# Altium schematic sheet PWR_DC_IN.SchDoc
size 420 x 297 mm; Scale: 1:1; DocumentType: Схема электрическая принципиальная; SheetNumber: 3; SheetTotal: 32; DocumentTypeShort: Э3; DocumentInvertoryNumber: ㅤ
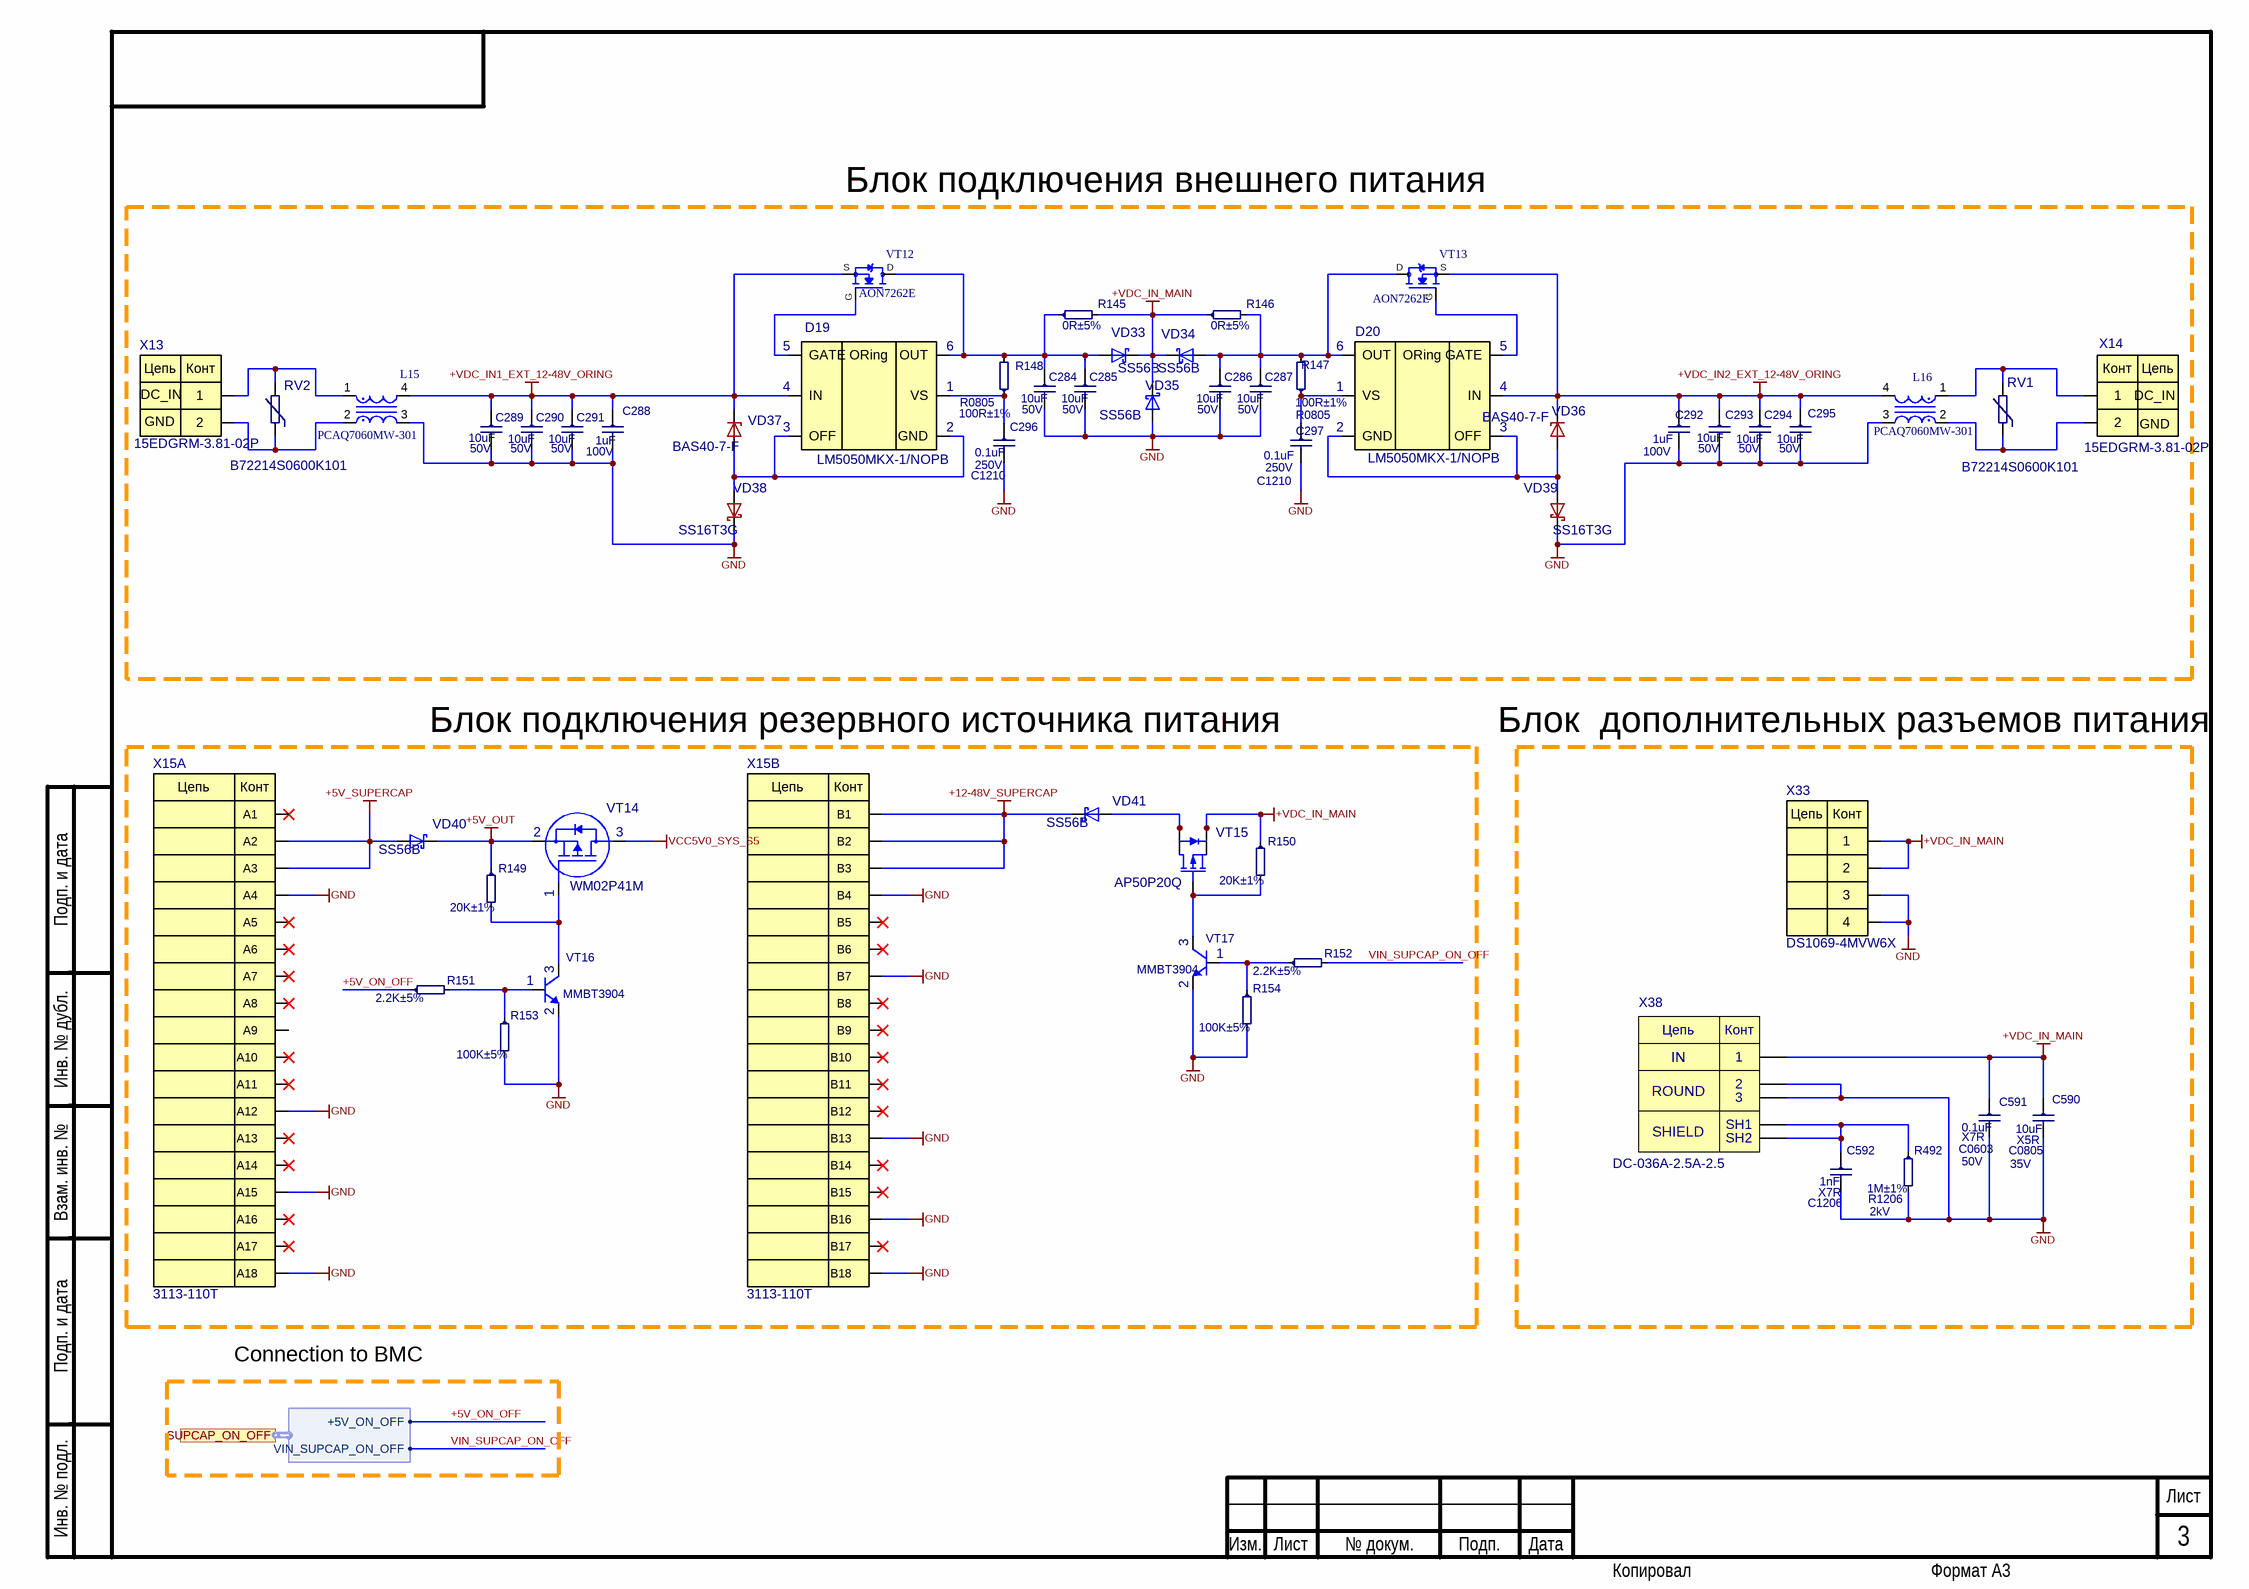
[diagram p0: PWR_DC_IN.SchDoc]

## Parts
C284  10uF  Voltage: 50V  [C1206]
C285  10uF  Voltage: 50V  [C1206]
C286  10uF  Voltage: 50V  [C1206]
C287  10uF  Voltage: 50V  [C1206]
C288  1uF  Voltage: 100V  [C1206]
C289  10uF  Voltage: 50V  [C1206]
C290  10uF  Voltage: 50V  [C1206]
C291  10uF  Voltage: 50V  [C1206]
C292  1uF  Voltage: 100V  [C1206]
C293  10uF  Voltage: 50V  [C1206]
C294  10uF  Voltage: 50V  [C1206]
C295  10uF  Voltage: 50V  [C1206]
C296  0.1uF  Voltage: 250V  [C1210]
C297  0.1uF  Voltage: 250V  [C1210]
C590  10uF  Dielectric: X5R  Voltage: 35V  [C0805]
C591  0.1uF  Dielectric: X7R  Voltage: 50V  [C0603]
C592  1nF  Dielectric: X7R  Voltage: 2kV  [C1206]
D19  LM5050MKX-1/NOPB  [LM5050MKX-1/NOPB]
D20  LM5050MKX-1/NOPB  [LM5050MKX-1/NOPB]
L15  PCAQ7060MW-301  [PCAQ7060MW-301]
L16  PCAQ7060MW-301  [PCAQ7060MW-301]
R145  0R±5%  [R2010]
R146  0R±5%  [R2010]
R147  100R±1%  [R0805]
R148  100R±1%  [R0805]
R149  20K±1%  [R0402]
R150  20K±1%  [R0402]
R151  2.2K±5%  [R0402]
R152  2.2K±5%  [R0402]
R153  100K±5%  [R0402]
R154  100K±5%  [R0402]
R492  1M±1%  [R1206]
RV1  B72214S0600K101  [Var_dia15.5]
RV2  B72214S0600K101  [Var_dia15.5]
VD33  SS56B  [DO-214AA]
VD34  SS56B  [DO-214AA]
VD35  SS56B  [DO-214AA]
VD36  BAS40-7-F  [SOT23]
VD37  BAS40-7-F  [SOT23]
VD38  SS16T3G  [DO-214AC]
VD39  SS16T3G  [DO-214AC]
VD40  SS56B  [DO-214AA]
VD41  SS56B  [DO-214AA]
VT12  AON7262E  [AON7262E]
VT13  AON7262E  [AON7262E]
VT14  WM02P41M  [SOT23]
VT15  AP50P20Q  [AP50P20Q]
VT16  MMBT3904  [SOT23]
VT17  MMBT3904  [SOT23]
X13  15EDGRM-3.81-02P  [15EDGRM-3.81-02P]
X14  15EDGRM-3.81-02P  [15EDGRM-3.81-02P]
X15  3113-110T  [3113-110T]  (parts A,B of 2)
X33  DS1069-4MVW6X  [DS1069-4MVW6X]
X38  DC-036A-2.5A-2.5  [DC-036A-2.5A-2.5]

## Ports
SUPCAP_ON_OFF (harness SUPCAP_ON_OFF)

## Harnesses
SUPCAP_ON_OFF: +5V_ON_OFF, VIN_SUPCAP_ON_OFF

## Nets
+5V_OUT: R149.1 VD40.1(K) VT14.2
+5V_SUPERCAP: VD40.2(A) X15.A2 X15.A3
+12-48V_SUPERCAP: VD41.1(K) X15.B1 X15.B2 X15.B3
+VDC_IN1_EXT_12-48V_ORING: C288.1 C289.1 C290.1 C291.1 D19.4(IN) L15.4 VD37.1(C) VT12.S
+VDC_IN2_EXT_12-48V_ORING: C292.1 C293.1 C294.1 C295.1 D20.4(IN) L16.4 VD36.1(C) VT13.S
+VDC_IN_MAIN: C590.1 C591.1 R145.2 R146.1 R150.1 VD33.1(K) VD34.1(K) VD35.1(K) VT15.1 VT15.2 VT15.3 X33.1 X33.2 X38.1(IN)
GND: C284.2 C285.2 C286.2 C287.2 C288.2 C289.2 C290.2 C291.2 C292.2 C293.2 C294.2 C295.2 C296.2 C297.2 C590.2 C591.2 C592.2 L15.3 L16.3 R153.2 R154.2 R492.2 VD35.2(A) VD38.1(C) VD39.1(C) VT16.2(E) VT17.2(E) X15.A4 X15.A12 X15.A15 X15.A18 X15.B4 X15.B7 X15.B13 X15.B16 X15.B18 X33.3 X33.4 X38.2(ROUND) X38.3(ROUND)
VCC5V0_SYS_S5: VT14.3
+5V_ON_OFF: R151.1 ; port SUPCAP_ON_OFF.+5V_ON_OFF
VIN_SUPCAP_ON_OFF: R152.2 ; port SUPCAP_ON_OFF.VIN_SUPCAP_ON_OFF
NetC284_1: C284.1 C285.1 D19.6(OUT) R145.1 R148.2 VD33.2(A) VT12.D
NetC286_1: C286.1 C287.1 D20.6(OUT) R146.2 R147.2 VD34.2(A) VT13.D
NetC296_1: C296.1 D19.1(VS) R148.1
NetC297_1: C297.1 D20.1(VS) R147.1
NetC592_1: C592.1 R492.1 X38.SH1 X38.SH2
NetD19_2: D19.2(GND) D19.3(OFF) VD37.2(A) VD38.2(A)
NetD19_5: D19.5(GATE) VT12.G
NetD20_2: D20.2(GND) D20.3(OFF) VD36.2(A) VD39.2(A)
NetD20_5: D20.5(GATE) VT13.G
NetL15_1: L15.1 RV2.2 X13.1
NetL15_2: L15.2 RV2.1 X13.2
NetL16_1: L16.1 RV1.2 X14.1
NetL16_2: L16.2 RV1.1 X14.2
NetR149_2: R149.2 VT14.1 VT16.3(C)
NetR150_2: R150.2 VT15.4 VT17.3(C)
NetR151_2: R151.2 R153.1 VT16.1(B)
NetR152_1: R152.1 R154.1 VT17.1(B)
NetVD41_2: VD41.2(A) VT15.5 VT15.6 VT15.7 VT15.8

Not connected (* = marked no-connect by the designer): X15 A1* A5* A6* A7* A8* A9 A10* A11* A13* A14* A16* A17* B5* B6* B8* B9* B10* B11* B12* B14* B15* B17*

## Notes on the sheet
- Блок подключения внешнего питания
- (near X13) DC_IN
- (near X14) DC_IN
- (near X13) GND
- (near X14) GND
- Блок подключения резервного источника питания
- Блок  дополнительных разъемов питания
- Connection to BMC
- Подп. и дата
- Инв. № дубл.
- Взам. инв. №
- Инв. № подл.
- Изм.
- Лист
- № докум.
- Подп.
- Дата
- Копировал
- Формат А3
- (in symbol 15EDGRM-3.81-02P) Цепь; Конт
- (in symbol 3113-110T, part A) Цепь; Конт
- (in symbol 3113-110T, part B) Цепь; Конт
- (in symbol DC-036A-2.5A-2.5) Цепь; Конт; SHIELD
- (in symbol DS1069-4MVW6X) Цепь; Конт
- (in symbol LM5050MKX-1/NOPB) ORing

## Library data of the parts
C284-C287 C289-C291 C293-C295 = 1206-X5R-50V-010uF±10%: Manufacturer: Yageo; NameFromManufacturer: CC1206KKX5R9BB106; Dielectric: X5R; Place: *); Tolerance: 10%; Check: False; Case: C1206; Part Number: 1206-X5R-50V-010uF±10%; Value: 10uF; Temperature: -55°C~85°C; ComponentLink2Description: Link to datasheet; ComponentLink1Description: DATASHEET; ComponentLink2URL: https://www.terraelectronica.ru/product/2097656; ComponentLink1URL: Datasheets/capacitors/UPY-GPHC_X5R_4V-to-50V_27.pdf; Last changed: 27.10.2022
C288 C292 = 1206-X7R-100V-1uF±10%: Manufacturer: CCTC; NameFromManufacturer: TCC1206X7R105K101HT; Dielectric: X7R; Place: *); Tolerance: 10%; Check: False; Case: C1206; Part Number: 1206-X7R-100V-1uF±10%; Value: 1uF; Temperature: -55°C~125°C; ComponentLink2Description: Link to datasheet; ComponentLink1Description: DATASHEET; ComponentLink2URL: https://www.digikey.com/en/products/detail/kemet/C1206C105K1RAC7800/5119820; ComponentLink1URL: Datasheets/capacitors/C1206C105K1RACTU.pdf; Last changed: 27.10.2022
C296 C297 = 1210-X7R-250V-0.1uF±10%: Manufacturer: Yageo; NameFromManufacturer: CC1210KKX7RYBB104; Dielectric: X7R; Place: *); Tolerance: 10%; Check: False; Case: C1210; Part Number: 1210-X7R-250V-0.1uF±10%; Value: 0.1uF; Temperature: -55°C~125°C; ComponentLink2Description: Link to datasheet; ComponentLink1Description: DATASHEET; ComponentLink2URL: https://www.electronshik.ru/item/YAG/CC1210KKX7RYBB104; ComponentLink1URL: Datasheets/capacitors/UPY-GPHC_X7R_6.3V-to-250V_22.pdf#Datasheets/capacitors/UPY-GPHC_X7R_6.3V-to-250V_22.pdf#; Last changed: 15.11.2022
C590 = 0805-X5R-35V-10uF±10%: *; Manufacturer: TDK Corporation; NameFromManufacturer: C2012X5R1V106K085AC; Place: *); Tolerance: 10%; Check: False; Case: C0805; Part Number: 0805-X5R-35V-10uF±10%; Value: 10uF; Temperature: -55°C~85°C; ComponentLink2Description: Link to datasheet; ComponentLink1Description: DATASHEET; ComponentLink2URL: https://ru.mouser.com/ProductDetail/TDK/C2012X5R1V106K085AC?qs=%2Fha2pyFadujDqt6GaOhNLapiXMVR473hecC3EhBEJAjxMNkR78ehMSD9s1oir4w0; ComponentLink1URL: Datasheets/capacitors/mlccspec_commercial_general_midvoltage_en.pdf; Last changed: 27.10.2022
C591 = 0603-X7R-50V-0.1uF±10%: Manufacturer: Yageo; NameFromManufacturer: CC0603KRX7R9BB104; Place: *); Tolerance: 10%; Check: False; Case: C0603; Part Number: 0603-X7R-50V-0.1uF±10%; Value: 0.1uF; Temperature: -55°C~125°C; ComponentLink2Description: Link to datasheet; ComponentLink1Description: DATASHEET; ComponentLink2URL: https://www.yageo.com/upload/media/product/productsearch/datasheet/mlcc/UPY-GPHC_X7R_6.3V-to-50V_18.pdf; ComponentLink1URL: Datasheets/capacitors/UPY-GPHC_X7R_6.3V-to-50V_18.pdf; Last changed: 27.10.2022
C592 = 1206-X7R-2K-1000pF±10%: Ceramic Capacitor 1206 1nF ±10% 2kV X7R; Manufacturer: Yageo; NameFromManufacturer: CC1206KKX7RDBB102; Place: *); Analog: 1206B102K202; Check: False; Case: C1206; Part Number: 1206-X7R-2K-1000pF±10%; Value: 1nF; Tolerance: 10%; Temperature: -55°C~125°C; ComponentLink2Description: Link to datasheet; ComponentLink1Description: DATASHEET; ComponentLink2URL: https://www.lcsc.com/product-detail/Multilayer-Ceramic-Capacitors-MLCC-SMD-SMT_YAGEO-CC1206KKX7RDBB102_C23631.html; Last changed: 09.04.2025
D19 D20 = LM5050MKX-1/NOPB: High-Side OR-ing FET Controller; Manufacturer: TI; Check: False; Part Number: LM5050MKX-1/NOPB; Value: LM5050MKX-1/NOPB; NameFromManufacturer: LM5050MKX-1/NOPB
L15 L16 = PCAQ7060MW-301: 300Ω@100MHz 10mΩ 2 SMD,7x6x3.8mm; Manufacturer: PROD Tech; MF: Panasonic Electronic; MP: EEH-ZA1V151P; Check: False; Availability: In Stock; Price: None; Package: RADIAL-2 Panasonic; SnapEDA_Link: https://www.snapeda.com/parts/EEH-ZA1V151P/Panasonic%20Electronic%20Components/view-part/2297820/?ref=snap; Value: PCAQ7060MW-301; Check_prices: https://www.snapeda.com/parts/EEH-ZA1V151P/Panasonic%20Electronic%20Components/view-part/2297820/?ref=eda; Purchase-URL: https://pricing.snapeda.com/search/part/EEH-ZA1V151P/?ref=eda; Part Number: PCAQ7060MW-301; NameFromManufacturer: PCAQ7060MW-301
R145 R146 = 2010-0.75W-0R-200ppm±5%: Chip Resistor 2010 0Ω ±5% 200V ±200ppm/℃ Thick Film; NameFromManufacturer: RC2010JK-070RL; Manufacturer: Yageo; Place: *); Value: 0R; Check: False; Case: R2010; Part Number: 2010-0.75W-0R-200ppm±5%; Tolerance: 5%; Temperature: -55°C~155°C; ComponentLink1Description: DATASHEET; ComponentLink1URL: https://www.lcsc.com/product-detail/Chip-Resistor-Surface-Mount_YAGEO-RC2010JK-070RL_C152156.html; Last changed: 16.07.2024
R147 R148 = 0805-0.125W-100R-100ppm±1%: *; NameFromManufacturer: RC0805FR-07100RL; Manufacturer: Yageo; Place: *); Value: 100R; Tolerance: 1%; Check: False; Case: R0805; Part Number: 0805-0.125W-100R-100ppm±1%; Temperature: -55°C~125°C; ComponentLink1Description: DATASHEET; ComponentLink1URL: https://eu.mouser.com/ProductDetail/YAGEO/RC0805FR-07100RL?qs=8Y8p%252BasKcI6MtXUgG4E6SQ%3D%3D; Datasheet: Datasheets/resistors/PYu-RC_Group_51_RoHS_L_11.pdf; Last changed: 27.10.2022
R149 R150 = 0402-0.0625W-20K-100ppm±1%: Chip Resistor 0402 20kΩ ±1% 50V ±100ppm/℃ Thick Film; NameFromManufacturer: RC0402FR-0720KL; Manufacturer: Yageo; Place: *); Value: 20K; Check: False; Case: R0402; Part Number: 0402-0.0625W-20K-100ppm±1%; Tolerance: 1%; Temperature: -55°C~155°C; ComponentLink1Description: DATASHEET; ComponentLink1URL: https://www.terraelectronica.ru/product/506449; Datasheet: Datasheets/resistors/PYu-RC_Group_51_RoHS_L_11.pdf; Last changed: 27.10.2022
R151 R152 = 0402-0.0625W-2.2K-100ppm±5%: *; NameFromManufacturer: RC0402JR-072K2L; Manufacturer: Yageo; Place: *); Value: 2.2K; Tolerance: 5%; Check: False; Case: R0402; Part Number: 0402-0.0625W-2.2K-100ppm±5%; Temperature: -55°C~155°C; ComponentLink1Description: DATASHEET; ComponentLink1URL: https://octopart.com/ac0402jr-072k2l-yageo-23514430?r=sp; Datasheet: Datasheets/resistors/PYu-AC_51_RoHS_L_8.pdf; Last changed: 27.10.2022
R153 R154 = 0402-0.0625W-100K-100ppm±5%: NameFromManufacturer: RC0402JR-07100KL; Manufacturer: Yageo; Place: *); Value: 100K; Tolerance: 5%; Check: False; Case: R0402; Part Number: 0402-0.0625W-100K-100ppm±5%; Temperature: -55°C~155°C; ComponentLink1Description: DATASHEET; ComponentLink1URL: https://ru.mouser.com/ProductDetail/YAGEO/RC0402JR-07100KL?qs=%2Fha2pyFadugNN0LzwXn2qCsICuw6vgLBeLL%252BmXUKy2OLGS9kgqrNBA%3D%3D; Datasheet: Datasheets/resistors/PYu-RC_Group_51_RoHS_L_11.pdf; Last changed: 27.10.2022
R492 = 1206-0.25W-1M-100ppm±1%: Chip Resistor 1206 1MΩ ±1% 200V ±100ppm/℃ Thick Film; NameFromManufacturer: RC1206FR-071ML; Manufacturer: Yageo; Place: *); Value: 1M; Check: False; Case: R1206; Part Number: 1206-0.25W-1M-100ppm±1%; Tolerance: 1%; Temperature: -55°C~155°C; ComponentLink1Description: DATASHEET; ComponentLink1URL: https://www.lcsc.com/product-detail/Chip-Resistor-Surface-Mount_YAGEO-RC1206FR-071ML_C108083.html?s_z=n_RC1206FR-071ML; Last changed: 09.04.2025
RV1 RV2 = B72214S2321K101: Varistor; Manufacturer: Epcos; Place: *); Voltage: 320V; Check: False; Case: CASE; Part Number: B72214S0600K101; Value: B72214S0600K101; Temperature: -40°C~105°C; ComponentLink1Description: DATASHEET; NameFromManufacturer: B72214S0600K101; ComponentLink1URL: https://www.chipdip.ru/product0/8003145013; Last changed: 27.10.2022
VD33-VD35 VD40 VD41 = B360BQ-13-F: Schottky Rectifier; Manufacturer: Yangjie (YJ); Place: S; Check: False; Part Number: SS56B; Value: SS56B; Temperature: -55°C~150°C; NameFromManufacturer: SS56B; Last changed: 27.10.2022
VD36 VD37 = LM4040D25: 600mA 1 Independent 40V 1V@40mA 200mA SOT-23 Single Diodes RoHS; Manufacturer: Diodes Incorporated; Place: *); Check: False; Part Number: BAS40-7-F; Value: BAS40-7-F; Temperature: -40°C~150°C; ComponentLink1Description: DATASHEET; NameFromManufacturer: BAS40-7-F; ComponentLink1URL: https://www.lcsc.com/product-detail/Voltage-Reference_Diodes-Incorporated-LM4040D25FTA_C107244.html; Last changed: 05.07.2024
VD38 VD39 = SS16T3G: Schottky Power Rectifier; Manufacturer: ON Semiconductor; Place: *); Check: False; Part Number: SS16T3G; Value: SS16T3G; Temperature: -55°C~150°C; ComponentLink1Description: DATASHEET; NameFromManufacturer: SS16T3G; ComponentLink1URL: https://www.onsemi.com/pdf/datasheet/ss16-d.pdf; Datasheet: Datasheets/diodes/SS16-D.PDF; Last changed: 07.12.2022
VT12 VT13 = AON7262E: 60V 6.2mΩ@10V,20A 2.2V@250uA N Channel DFN-8(3.3x3.3) MOSFET; Manufacturer: Alpha & Omega; Check: False; Part Number: AON7262E; NameFromManufacturer: AON7262E; Value: AON7262E
VT14 = WM02P41M: Small signal mosfet; Manufacturer: Wayon; Place: S; Voltage: -20V; Check: False; Part Number: WM02P41M; Value: WM02P41M; Temperature: -55°C~150°C; ComponentLink1Description: DATASHEET; NameFromManufacturer: WM02P41M; ComponentLink1URL: https://www.terraelectronica.ru/product/5031341; Datasheet: Datasheets/transistors/UM6K34NTCN.pdf; Last changeв: 27.10.2022
VT15 = AP50P20Q: 20V 50A 40W 6.6mΩ@4.5V,15A 650mV@250uA P Channel WDFN-8(3x3) MOSFETs; Manufacturer: ALLPOWER; Check: False; Part Number: AP50P20Q; Value: AP50P20Q; NameFromManufacturer: AP50P20Q
VT16 VT17 = MMBT3904: NPN transistor; Manufacturer: Diotec Semiconductor; Place: S; Voltage: 40V; Check: False; Part Number: MMBT3904; Value: MMBT3904; Temperature: -55°C~150°C; ComponentLink1Description: DATASHEET; NameFromManufacturer: MMBT3904; ComponentLink1URL: https://www.terraelectronica.ru/product/607582; Datasheet: Datasheets/transistors/mmbt3904.pdf; Last changeв: 27.10.2022
X13 X14 = 15EDGRM-3.81-02P: Разъемный клеммный блок на плату, 2 контакта. Серия 15EDGRM-3.81; Manufacturer: DEGSON; Check: False; Part Number: 15EDGRM-3.81-02P; Value: 15EDGRM-3.81-02P; NameFromManufacturer: 15EDGRM-3.81-02P
X15 = 3113-110T: PCI Connector, Vertical, Surface Mount, x1, 36 Positions, 1.00mm (0.039in) Pitch; Manufacturer: UMAX; Check: False; Part Number: 3113-110T; Value: 3113-110T; NameFromManufacturer: 3113-110T
X33 = DS1069-4MVW6X: 1 XH 4P -25℃~+85℃ 2.5mm 3A 250V 1x4P Through Hole,P=2.5mm Headers, Male Pins RoHS; Manufacturer: CONNFLY; Check: False; Part Number: DS1069-4MVW6X; Value: DS1069-4MVW6X; NameFromManufacturer: DS1069-4MVW6X
X38 = DC-036A-2.5A-2.5: DC Power Connector Bend-in, -20℃~+70℃, 2.5mm 6mm, 2.5A 24V; Manufacturer: XKB Connection; Place: *); Check: False; Part Number: DC-036A-2.5A-2.5; Value: DC-036A-2.5A-2.5; Temperature: -20°C~70°C; ComponentLink1Description: DATASHEET; NameFromManufacturer: DC-036A-2.5A-2.5; ComponentLink1URL: https://www.lcsc.com/product-detail/dc-power-connectors_xkb-connection-dc-036a-2-5a-2-5_C500106.html; Last changed: 4/8/2025